# EAGLE design Adafruit GPS Logger Shield (EAGLE 6.3)
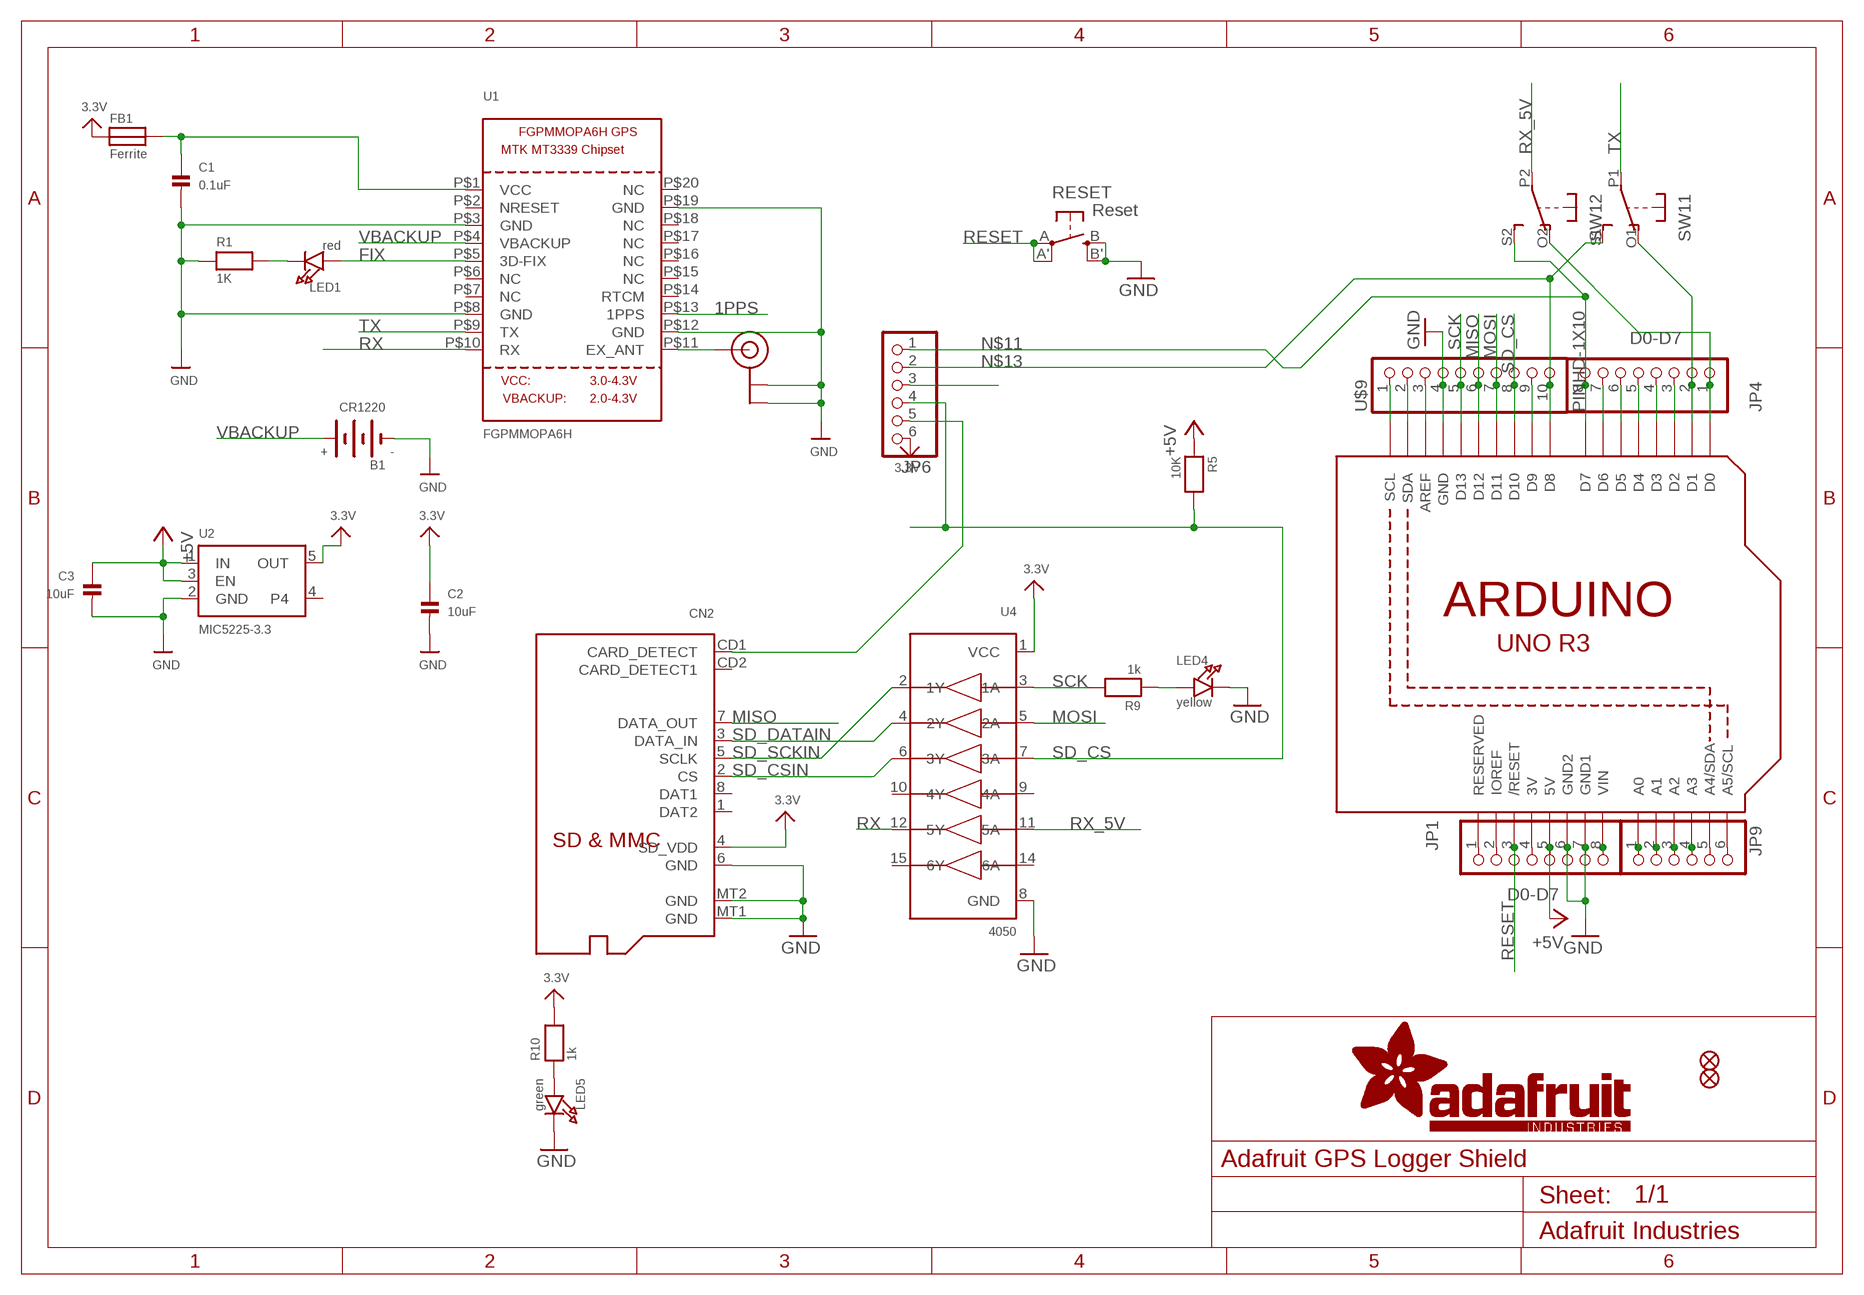
[diagram p0: schematic, sheet 1]

## Parts
B1  CR1220  BATTERYCR1220_SMT  [CR1220]
C1  0.1uF  CAP_CERAMIC0805  [0805@1]
C2  10uF  CAP_CERAMIC0805  [0805@1]
C3  10uF  CAP_CERAMIC0805  [0805@1]
CN2  MICROSD  [MICROSD]
FB1  Ferrite  FERRITE0805  [0805@1]
FID1  FIDUCIAL""  [FIDUCIAL_1MM]
FID2  FIDUCIAL""  [FIDUCIAL_1MM]
JP1  D0-D7  PINHD-1X8BIG  [1X08-BIG]
JP4  D0-D7  PINHD-1X8BIG  [1X08-BIG]
JP6  PINHD-1X6B  [1X06-BIG]
JP9  PINHD-1X6B  [1X06-BIG]
LED1  red  LED0805  [CHIPLED_0805]
LED4  yellow  LED0805  [CHIPLED_0805]
LED5  green  LED0805  [CHIPLED_0805]
R1  1K  RESISTOR0805  [0805]
R5  10K  RESISTOR0805  [0805]
R9  1k  RESISTOR0805  [0805]
R10  1k  RESISTOR0805  [0805]
RESET  Reset  SPST_TACT-EVQQ2  [EVQ-Q2]
SW1  DPDT-EG1390  [EG1390]
U1  FGPMMOPA6H  GPS_FGPMMOPA6H  [FGPMMOPA6H]
U2  MIC5225-3.3  VREG_SOT23-5  [SOT23-5]
U3  ARDUINOR3-DIMENSION  [ARDUINOR3]
U4  4050  74HC4050D  [SOIC16]
U$9  PINHD-1X10  [1X10-BIG]
U$20  U.FL  [U.FL]

## Nets
1PPS: JP6.3 U1.P$13(1PPS)
3.3V: C2.1 CN2.4(SD_VDD) FB1.1 JP6.6 R10.2 U2.5(OUT) U4.1(VCC)
+5V: C3.1 JP1.5 R5.1 U2.1(IN) U2.3(EN) U3.5V
FIX: LED1.A U1.P$5(3D-FIX)
GND: B1.- C1.2 C2.2 C3.2 CN2.6(GND) CN2.MT1(GND) CN2.MT2(GND) JP1.6 JP1.7 LED4.C LED5.C R1.1 RESET.B'(S1) RESET.B(S) U1.P$3(GND) U1.P$8(GND) U1.P$12(GND) U1.P$19(GND) U2.2(GND) U3.GND U3.GND1 U3.GND2 U4.8(GND) U$9.4 U$20.P$1(GND) U$20.P$2(GND)
MISO: CN2.7(DATA_OUT) U3.D12 U$9.6
MOSI: U3.D11 U4.5(2A) U$9.7
N$1: C1.1 FB1.2 U1.P$1(VCC)
N$2: LED1.C R1.2
N$3: JP1.1 U3.RESERVED
N$4: U1.P$11(EX_ANT) U$20.P$3(SIGNAL)
N$5: JP1.2 U3.IOREF
N$6: JP1.4 U3.3V
N$7: U3.SCL U$9.1
N$8: LED4.A R9.1
N$9: JP9.6 U3.A5(A5/SCL)
N$10: JP9.5 U3.A4(A4/SDA)
N$11: JP4.8 JP6.1 SW1.S2(2:S) U3.D7
N$12: U3.SDA U$9.2
N$13: JP6.2 SW1.S1(1:S) U3.D8 U$9.10
N$14: JP4.2 SW1.O1(1:O) U3.D1
N$15: JP1.8 U3.VIN
N$89: JP4.3 U3.D2
N$90: JP4.4 U3.D3
N$98: JP4.5 U3.D4
N$99: JP4.6 U3.D5
N$100: JP4.7 U3.D6
N$108: U3.AREF U$9.3
N$110: U3.D9 U$9.9
N$150: LED5.A R10.1
N$154: JP9.1 U3.A0
N$164: JP9.2 U3.A1
N$181: JP9.3 U3.A2
N$182: JP9.4 U3.A3
N$201: JP4.1 SW1.O2(2:O) U3.D0
RESET: JP1.3 RESET.A'(P1) RESET.A(P) U3.RESET(/RESET)
RX: U1.P$10(RX) U4.12(5Y)
RX_5V: SW1.P2(2:P) U4.11(5A)
SCK: R9.2 U3.D13 U4.3(1A) U$9.5
SD_CD: CN2.CD1(CARD_DETECT) JP6.5
SD_CS: JP6.4 R5.2 U3.D10 U4.7(3A) U$9.8
SD_CSIN: CN2.2(CS) U4.6(3Y)
SD_DATAIN: CN2.3(DATA_IN) U4.4(2Y)
SD_SCKIN: CN2.5(SCLK) U4.2(1Y)
TX: SW1.P1(1:P) U1.P$9(TX)
VBACKUP: B1.+$1(+) U1.P$4(VBACKUP)
Unconnected: CN2.1(DAT2) CN2.8(DAT1) CN2.CD2(CARD_DETECT1) U1.P$2(NRESET) U1.P$6(NC) U1.P$7(NC) U1.P$14(RTCM) U1.P$15(NC) U1.P$16(NC) U1.P$17(NC) U1.P$18(NC) U1.P$20(NC) U2.4 U4.9(4A) U4.10(4Y) U4.14(6A) U4.15(6Y)

## Library data of the parts
B1 = microbuilder:BATTERY
C1-C3 = microbuilder:CAP_CERAMIC: Ceramic Capacitors 0402 - 0402 Surface Mount Capacitors 16pF 50V 5% [Digikey: 445-4899-2-ND] 18pF 50V 5% [Digikey: 490-1281-2-ND] 22pF 50V 5% [Digikey: 490-1283-2-ND] 68pF 50V 5% [Digikey: 490-1289-2-ND] 0.1uF 10V 10% [Digikey: 490-1318-2-ND] 1.0uF 6.3V 10% [Digikey: 490-1320-2-ND] 0603 - 0603 Surface Mount Capacitors 16 pF 50V 5% [Digikey: 445-5051-2-ND] 22 pF 50V [Digikey: PCC220ACVTR-ND] 33 pF 50V 5% [Digikey: 490-1415-1-ND] 56pF 50V 5% [Digikey: 490-1421-1-ND] 220pF 50V 5% [Digikey: 445-1285-1-ND] 680 pF 50V 2200 pF 50V 5% C0G [Digikey: 445-1297-1-ND] 5600 pF 100V 5% X7R [Digikey: 478-3711-1-ND] 0.1 µF 25V 10% [Digikey: PCC2277TR-ND] 0.22 µF 16V 10% X7R [Digikey: 445-1318-1-ND] 1.0 µF 25V 10% [Digikey: 445-5146-2-ND] 0603 - RF Specific 3pF 250V +/-0.1pF RF [Digikey: 712-1347-1-ND] 18 pF 250V 5% [Digikey: 478-3505-1-ND or 712-1322-1-ND] 56 pF 250V 5% C0G RF [Digikey: 490-4867-1-ND] 68 pF 250V RF [Digikey: 490-4868-1-ND] 0805 - 0805 Surface Mount Capacitors 220 pF 250V 2% RF Ceramic Capacitor [Digikey: 712-1398-1-ND] 1000 pF 50V 2% NP0 Ceramic Capacitor [Digikey: 478-3760-1-ND] 0.1 µF 25V 10% Ceramic Capacitor [Digikey: PCC1828TR-ND] 1.0 µF 16V 10% Ceramic Capacitor[Digikey: 490-1691-2-ND] 10.0 µF 10V 10% Ceramic Capacitor[Digikey: 709-1228-1-ND] 10.0 uF 16V 10% Ceramic Capacitor [Digikey: 478-5165-2-ND] 47 uF 6.3V 20% Ceramic Capacitor [Digikey: 587-1779-1-ND or 399-5506-1-ND] 1206 - 1206 Surface Mount Capacitors 47uF 10V 20% Ceramic Capacitor [Digikey: 490-5528-1-ND or 399-5508-1-ND or 445-6010-1-ND] 100uF 6.3V -20%, +80% Y5V Ceramic Capacitor (Digikey: 490-4512-1-ND, Mouser: 81-GRM31CF50J107ZE1L)
CN2 = microbuilder:MICROSD: MicroSD/Transflash Card Holder with SPI pinout 3M: 2908-05WB-MG 4UConnector: 19656 Footprint courtesy: Adafruit Industries
FB1 = microbuilder:FERRITE: Ferrite Bead 0603 MMZ1608B121C - 120 Ohm, 600mA Ferrite Chip - Digikey: 445-2164-1-ND BK1608HW121-T - 120 Ohm, 600mA Ferrite Chip - Digikey: 587-1876-2-ND
FID1 FID2 = microbuilder:FIDUCIAL: Fiducial Alignment Points Various fiducial points for machine vision alignment.
JP1 JP4 = adafruit:PINHD-1X8: PIN HEADER
JP6 JP9 = adafruit:PINHD-1X6: PIN HEADER
LED1 LED4 LED5 = microbuilder:LED: LED 0603 - 0603 Surface Mount Package 2mA: Green LED - Low Power (3.9mcd, 2ma, 1.7Vf) - Digikey: 475-2709-2-ND Orange LED - Low Power (9.8mcd, 2ma, 1.8Vf) - Digikey: 475-1194-2-ND Red LED - Low Power (5mcd, 2ma, 1.8Vf) - Digikey: 475-1195-2-ND Yellow LED - Low Power (7mcd, 2ma, 1.8Vf) - Digikey: 475-1196-2-ND 5mA: Blue LED - Low Power (17mcd, 5ma, 2.9Vf) - Digikey: LNJ937W8CRACT-ND 0805 - 0805 Surface Mount Package 2mA: Red LED (8.8mcd, 2mA, 1.8Vf, Clear) - Low Power [Digikey: 475-2510-1-ND] Green LED (5mcd, 2mA, 1.8Vf, Clear) - Low Power [Digikey: 475-2730-1-ND] Yellow LED (11.3mcd, 2mA, 1.8Vf, Clear) - Low Power [Digikey: 475-2555-1-ND] 20mA: Red LED (104mcd, 20mA, Diffused) - LS R976 [Digikey: 475-1278-6-ND] Red LED (12mcd, 20mA, 2.0Vf, Clear) - APT2012EC [Digikey: 754-1128-1-ND] Green LED (15mcd, 20mA, 2.2Vf, Clear) - APT2012GC [Digikey: 754-1131-1-ND] Orange LED (160mcd, 20mA, 2.1Vf, Clear) - APT2012SECK [Digikey: 754-1130-1-ND] 1206 - 1206 Surface Mount Package Green LED (26mcd, 20mA, Diffused) - LG N971 [Digikey: 475-1407-6-ND] Red LED (15mcd, 20mA, Diffused) - LH N974 [Digikey: 475-1416-6-ND]
R1 R5 R9 R10 = microbuilder:RESISTOR: Resistors 0402 - 0402 Surface Mount Package 22 Ohm 1% 1/16W [Digikey: 311-22.0LRTR-ND] 33 Ohm 5% 1/16W 1.0K 5% 1/16W 1.5K 5% 1/16W 2.0K 1% 1/16W 10.0K 1% 1/16W [Digikey: 311-10.0KLRTR-ND] 10.0K 5% 1/16W [Digikey: RMCF0402JT10K0TR-ND] 12.1K 1% 1/16W [Digikey: 311-22.0LRTR-ND] 100.0K 5% 1/16W 0603 - 0603 Surface Mount Package 0 Ohm 1/10 Watt 1% Resistor 15 Ohm 1/10 Watt 1% Resistor 33 Ohm 1/10 Watt 1% Resistor 49.9 Ohm 1/10 Watt 1% Resistor 100 Ohm 1/10 Watt 1% Resistor 150 Ohm 1/10 Watt 1% Resistor 240 Ohm 1/10 Watt 1% Resistor 390 Ohm 1/10 Watt 1% Resistor 560 Ohm 1/10 Watt 1% Resistor 680 Ohm 1/10 Watt 1% Resistor 750 Ohm 1/10 Watt 1% Resistor 1.0K Ohm 1/10 Watt 1% Resistor 1.5K Ohm 1/10 Watt 1% Resistor 2.0K Ohm 1/10 Watt 1% Resistor 2.2K Ohm 1/10 Watt 1% Resistor 3.3K Ohm 1/10 Watt 1% Resistor 4.7K Ohm 1/10 Watt 1% Resistor 10.0K Ohm 1/10 Watt 1% Resistor 12.0K Ohm 1/10 Watt 1% Resistor 12.1K Ohm 1/10 Watt 1% Resistor 20.0K Ohm 1/10 Watt 1% Resistor 33.0K Ohm 1/10 Watt 1% Resistor 100.0K Ohm 1/10 Watt 1% Resistor 0805 - 0805 Surface Mount Package 0 Ohm 1/8 Watt 1% Resistor 33 Ohm 1/8 Watt 1% Resistor 100 Ohm 1/8 Watt 1% Resistor 150 Ohm 1/8 Watt 1% Resistor 200 Ohm 1/8 Watt 1% Resistor 240 Ohm 1/8 Watt 1% Resistor 330 Ohm 1/8 Watt 1% Resistor 390 Ohm 1/8 Watt 1% Resistor 470 Ohm 1/8 Watt 1% Resistor 1.0K Ohm 1/8 Watt 1% Resistor 1.5K Ohm 1/8 Watt 1% Resistor 2.0K Ohm 1/8 Watt 1% Resistor 4.7K Ohm 1/8 Watt 1% Resistor 5.1K Ohm 1/8 Watt 1% Resistor 5.6K Ohm 1/8 Watt 1% Resistor 10.0K Ohm 1/8 Watt 1% Resistor 22.0K Ohm 1/8 Watt 1% Resistor 33.0K Ohm 1/8 Watt 1% Resistor 100K Ohm 1/8 Watt 1% Resistor 1206 - 1206 Surface Mount Package 2012 - 2010 Surface Mount Package 0.11 Ohm 1/2 Watt 1% Resistor - Digikey: RHM.11UCT-ND
RESET = adafruit:SPST_TACT: SMT 6mm switch, EVQQ2 series http://www.ladyada.net/library/eagle
SW1 = adafruit:DPDT
U1 = microbuilder:GPS_FGPMMOPA6H: GPS Module - MTK MT3339 Chipset, -165dBm sensitivity, 22 channels, 10Hz, auto-select external antenna options
U2 = microbuilder:VREG_SOT23-5: SOT23-5 Fixed Voltage Regulators To better organise some of the SOT23-5 fixed voltage regulators in this library, this new part was created. Part Current Out V Out V In V Dropout Digikey Part No. ADP121 150mA 3.3V 3.4-5.5V 0.09V @ 150mA ADP121-AUJZ33R7CT-ND ADP121 150mA 3.0V 3.1-5.5V 0.09V @ 150mA ADP121-AUJZ30R7CT-ND ADP122 300mA 3.3V 3.4-5.5V 0.085V @ 300mA ADP122AUJZ-3.3-R7CT-ND ADP1712 300mA 3.3V 3.5-5.5V 0.17V @ 300mA ADP1712AUJZ-3.3-R7TR-ND AP7311 (Low Cost) 150mA 3.3V 3.5-6V 0.15V @ 150mA AP7311-33WG-7DICT-ND LD39015M18R 150mA 1.8V 1.9V-5.5V 0.08V @ 100mA 497-6977-1-ND MCP1824T-3302E/OT 300mA 3.3V 3.5V-6V 0.2V @ 300mA MCP1824T-3302E/OTCT-ND MIC5205-2.5YM5 TR 150mA 2.5V 2.7-16V 0.165V @ 150mA 576-1257-2-ND MIC5205-3.0YM5 TR 150mA 3.0V 3.2V-16V 0.165V @ 150mA 576-1258-2-ND MIC5205-3.3YM5 TR 150mA 3.3V 3.5V-16V 0.165V @ 150mA 576-1259-2-ND TPS780330220 150mA 3.3V+2.2V 3.6-5.5V 250mV Max 296-23332-1-ND TDA3663/N1,135 100mA 3.3V 3.5-45V 0.18V @ 50mA 568-5343-1-ND
U3 = adafruit:ARDUINOR3: This is a new object for the new Arduino R3 - with extra pins that you may want to use (such as IOref, and duplicated A4/A5
U4 = microbuilder:74HC4050D: 6-channel level shifter 74HC4050D - 2V-6V Supply Digikey: 74HC4050D,653-ND Mouser: 771-74HC4050D-T
U$9 = adafruit:PINHD-1X10: Pin header 1x10 0.1" spacing With round pins
U$20 = microbuilder:U.FL: U.FL Antenna Connector

## Board
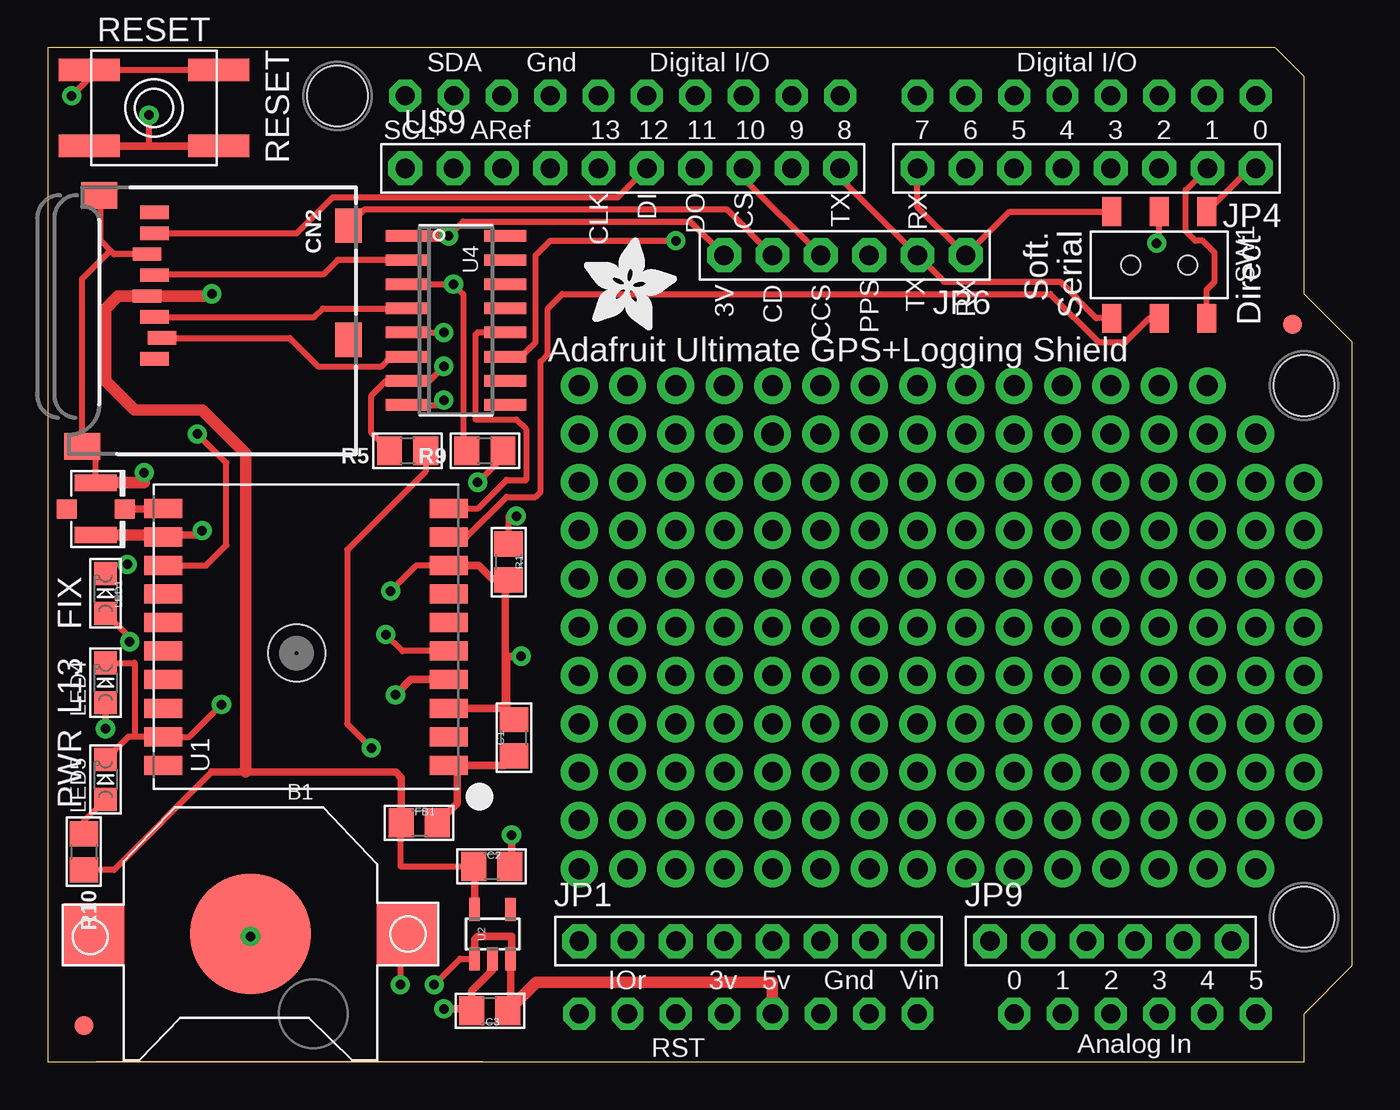
[diagram p1: board, top side]
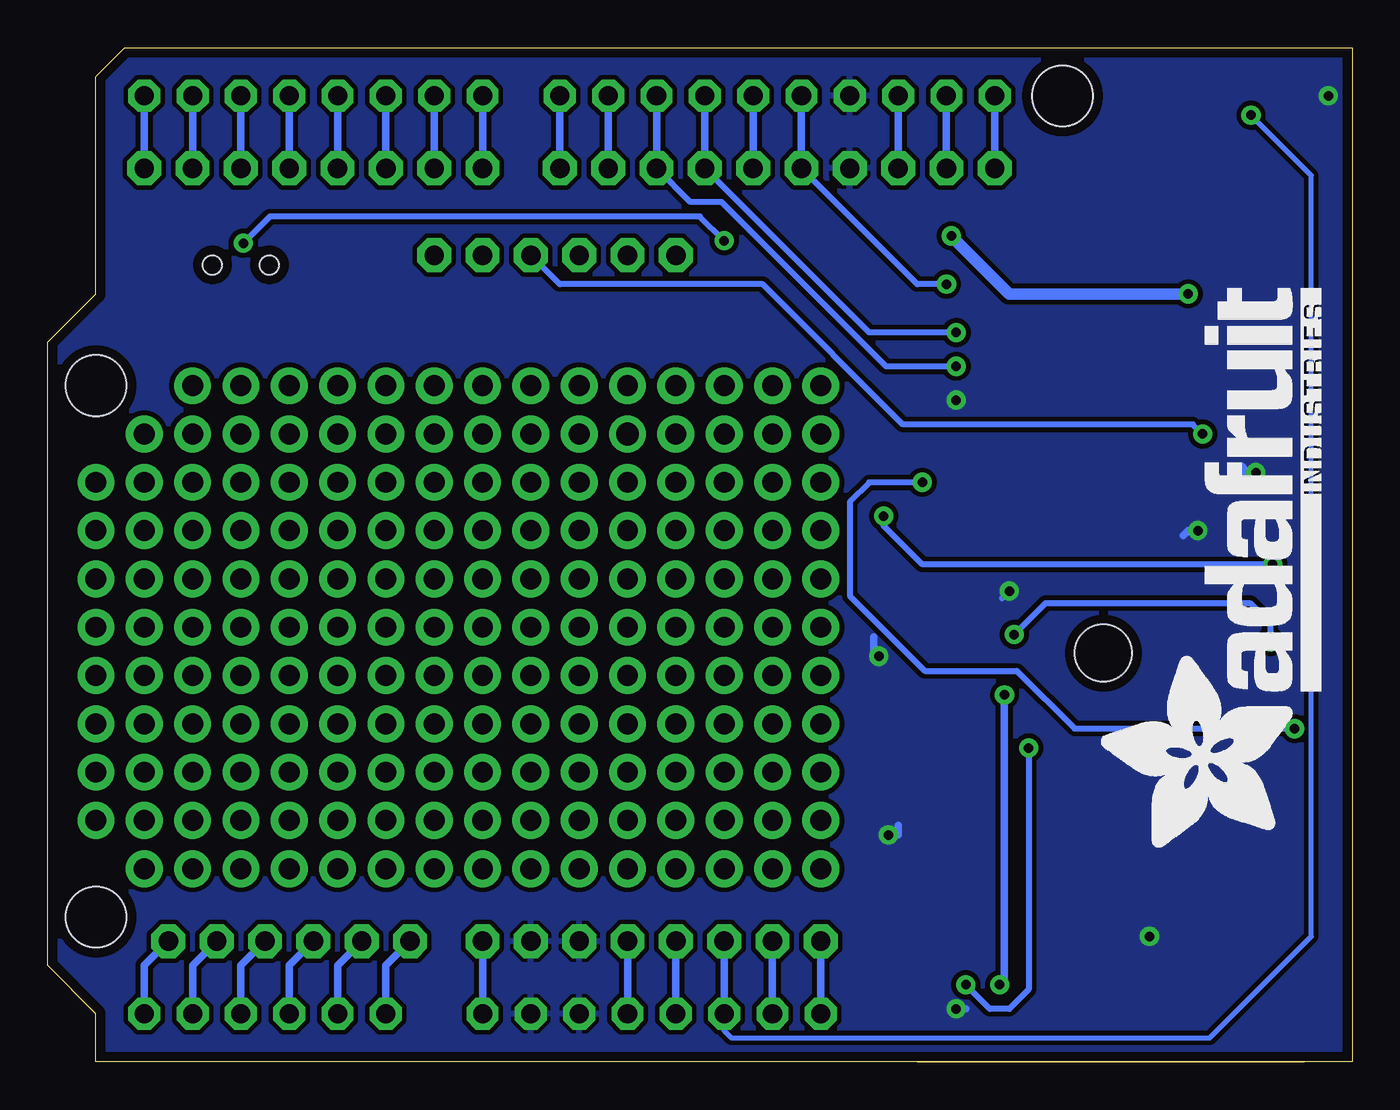
[diagram p2: board, bottom side, seen from below]

Size 68.58 x 53.34 mm. Coordinates in mm from the lower left corner, seen from the top.
Outline: 22.86,0 2.54,0
Copper layers (1*16): Top 0.035mm / dielectric 1.5mm / Bottom 0.035mm
Design rules "default": minimum track width 8mil, minimum drill 0.4mm, track to track 10mil, track to pad 10mil, pad to pad 10mil, via to via 10mil, smd to smd 8mil, copper to edge 20mil, drill to drill 8mil, minimum pad ring 8mil, minimum via ring 10mil, stop-mask expansion 3mil, vias tented up to drill 20mil, thermal gap 8mil
Holes 3.2 mm at 15.24,50.8 66.04,35.56 66.04,7.62

### Footprints (pad centres in the part's own frame; a part is rotated, then mirrored left to right if it is on the bottom)
CR1220 = smd 3.2 x 3.2: +$1 -8.225,0; +$2 8.225,0 | smd 6.35 x 6.35: - 0,0
0805@1 = smd 1.3 x 1.5: 1 -0.95,0; 2 0.95,0
MICROSD = smd 0.7 x 1.5: 1 9,-10.64; 2 7.9,-10.24; 3 6.8,-10.64; 4 5.7,-11.04; 5 4.6,-10.64; 6 3.5,-11.04; 7 2.4,-10.64; 8 1.3,-10.64 | smd 1.8 x 1.4: CD1 2,-0.44; CD2 8,-0.44 | smd 1.4 x 1.9: MT1 0.4,-13.54; MT2 13.6,-14.44
FIDUCIAL_1MM = smd 1 x 1: 1 0,0
1X08-BIG = drill 1.016 pad 1.778 octagon: 1 -8.89,0; 2 -6.35,0; 3 -3.81,0; 4 -1.27,0; 5 1.27,0; 6 3.81,0; 7 6.35,0; 8 8.89,0
1X06-BIG = drill 1.016 pad 1.778 octagon: 1 -6.35,0; 2 -3.81,0; 3 -1.27,0; 4 1.27,0; 5 3.81,0; 6 6.35,0
CHIPLED_0805 = smd 1.2 x 1.2: A 0,-1.05; C 0,1.05
0805 = smd 1.3 x 1.5: 1 -0.95,0; 2 0.95,0
EVQ-Q2 = smd 3.2 x 1.2: A -3.4,-2; A' 3.4,-2; B -3.4,2; B' 3.4,2
EG1390 = smd 1 x 1.5: O1 -2.5,2.8; O2 -2.5,-2.8; P1 0,2.8; P2 0,-2.8; S1 2.5,2.8; S2 2.5,-2.8 | hole 1: 1.5,0; -1.5,0
FGPMMOPA6H = smd 2 x 1: P$1 -7.5,6.75; P$2 -7.5,5.25; P$3 -7.5,3.75; P$4 -7.5,2.25; P$5 -7.5,0.75; P$6 -7.5,-0.75; P$7 -7.5,-2.25; P$8 -7.5,-3.75; P$9 -7.5,-5.25; P$10 -7.5,-6.75; P$11 7.5,-6.75; P$12 7.5,-5.25; P$13 7.5,-3.75; P$14 7.5,-2.25; P$15 7.5,-0.75; P$16 7.5,0.75; P$17 7.5,2.25; P$18 7.5,3.75; P$19 7.5,5.25; P$20 7.5,6.75 | hole 3: 0.5,0.85
SOT23-5 = smd 0.55 x 1.2: 1 -0.95,-1.3; 2 0,-1.3; 3 0.95,-1.3; 4 0.95,1.3; 5 -0.95,1.3
ARDUINOR3 = drill 1 pad 1.676 octagon: 3V 35.56,2.54; 5V 38.1,2.54; A0 50.8,2.54; A1 53.34,2.54; A2 55.88,2.54; A3 58.42,2.54; A4 60.96,2.54; A5 63.5,2.54; AREF 23.876,50.8; D0 63.5,50.8; D1 60.96,50.8; D2 58.42,50.8; D3 55.88,50.8; D4 53.34,50.8; D5 50.8,50.8; D6 48.26,50.8; D7 45.72,50.8; D8 41.656,50.8; D9 39.116,50.8; D10 36.576,50.8; D11 34.036,50.8; D12 31.496,50.8; D13 28.956,50.8; GND 26.416,50.8; GND1 43.18,2.54; GND2 40.64,2.54; IOREF 30.48,2.54; RESERVED 27.94,2.54; RESET 33.02,2.54; SCL 18.796,50.8; SDA 21.336,50.8; VIN 45.72,2.54
SOIC16 = smd 0.6 x 2.2: 1 -4.445,-2.6; 2 -3.175,-2.6; 3 -1.905,-2.6; 4 -0.635,-2.6; 5 0.635,-2.6; 6 1.905,-2.6; 7 3.175,-2.6; 8 4.445,-2.6; 9 4.445,2.6; 10 3.175,2.6; 11 1.905,2.6; 12 0.635,2.6; 13 -0.635,2.6; 14 -1.905,2.6; 15 -3.175,2.6; 16 -4.445,2.6
1X10-BIG = drill 1.016 pad 1.778 octagon: 1 -11.43,0; 2 -8.89,0; 3 -6.35,0; 4 -3.81,0; 5 -1.27,0; 6 1.27,0; 7 3.81,0; 8 6.35,0; 9 8.89,0; 10 11.43,0
U.FL = smd 2.2 x 0.85: P$1 0,1.375; P$2 0,-1.375 | smd 1.05 x 1: P$3 1.525,0; P$4 -1.525,0

### Placement (x,y rotation side)
B1  10.67,6.73 180 top
C1  24.51,17.04 90 top
C2  23.34,10.29 0 top
C3  23.24,2.69 180 top
CN2  16.26,45.97 270 top
FB1  19.53,12.57 0 top
FID1  1.91,1.91 0 top
FID2  65.43,38.78 0 top
JP1  36.83,6.35 0 top
JP4  54.61,46.99 180 top
JP6  41.91,42.42 180 top
JP9  55.88,6.35 0 top
LED1  3.05,24.64 0 top
LED4  3.05,19.94 0 top
LED5  3.05,14.86 0 top
R1  24.23,26.29 90 top
R5  18.92,32.13 180 top
R9  22.99,32.13 180 top
R10  1.91,11.05 270 top
RESET  5.59,50.16 0 top
SW1  58.42,41.91 180 top
U1  13.59,22.35 180 top
U2  23.39,6.73 0 top
U3  0,0 0 top
U4  21.46,38.99 270 top
U$9  30.23,46.99 0 top
U$13  [ADAFRUIT_5MM]  28.19,38.48 0 top
U$15  [ADAFRUIT_TEXT_30MM]  1.65,11.05 90 bottom
U$20  2.54,29.08 0 top

### Tracks (layer width: path | path; a pad name or v marks a point on that pad's centre or on a via)
1PPS  (via drill 0.5)
  Top 0.305: U1.P$13 8.32,26.1 9.4,27.18 9.4,31.5 v7.87,33.02
  Bottom 0.305: v7.87,33.02 8.38,33.53 23.62,33.53 30.99,40.89 41.66,40.89 JP6.3
3.3V  (via drill 0.5)
  Top 0.305: 8.64,15.24 3.5,10.1 R10.2 | 18.54,12.53 18.54,10.29 C2.1 | v21.08,43.43 21.84,44.2 33.78,44.2 JP6.6
  Top 0.406: C2.1 22.44,10.24 U2.5 | 18.54,12.53 FB1.1 18.58,14.94 18.29,15.24 10.41,15.24 8.64,15.24
  Top 0.61: 10.41,15.24 10.41,32 8.13,34.29 4.57,34.29 3.05,35.81 3.05,39.62 3.7,40.27 CN2.4 8.52,40.27 v8.64,40.39 | U4.1 v21.08,43.43
  Bottom 0.61: v21.08,43.43 18.03,40.39 v8.64,40.39
+5V  (via drill 0.5)
  Top 0.305: R5.1 19.87,31.05 15.75,26.92 15.75,17.78 v17.02,16.51 | v20.32,4.06 21.69,5.43 U2.1
  Top 0.406: U2.1 22.44,6.44 22.61,6.6 24.38,6.6 24.38,5.47 U2.3 24.34,2.84 C3.1
  Top 0.61: C3.1 25.69,4.19 38.1,4.19 U3.5V
  Bottom 0.305: v17.02,16.51 17.02,3.81 18.03,2.79 19.05,2.79 v20.32,4.06
  Bottom 0.406: U3.5V JP1.5
FIX  (via drill 0.5)
  Top 0.305: LED1.A 4.32,22.32 v4.32,22.1 | U1.P$5 18.66,21.6 v17.78,22.48
  Bottom 0.305: v17.78,22.48 16.13,24.13 5.38,24.13 4.32,23.07 v4.32,22.1
GND  (via drill 0.5)
  Top 0.305: RESET.B' RESET.B 2.19,51.72 v1.27,50.8 | CN2.6 3.5,42.47 3.3,42.67 | 3.3,42.67 2.79,43.18 2.79,45.5 CN2.MT1 | 3.3,42.67 1.82,41.19 CN2.MT2 2.54,31.65 U$20.P$1 | 4.57,17.1 U1.P$19 7.45,17.1 v9.14,18.8 | 4.57,17.1 4.24,17.1 LED5.C | U4.8 20.57,34.54 v20.83,34.8 | LED4.C 4.57,20.99 4.57,17.1 | U1.P$8 19.37,26.1 v18.03,24.77
  Top 0.406: U1.P$3 23.9,18.6 24.05,18.46 | 24.05,18.46 C1.2 24.13,17.99 24.13,21.34 v24.89,21.34 | U1.P$8 22.67,26.1 23.37,25.4 24.11,25.4 | 24.05,18.46 24.05,25.34 24.11,25.4 | U2.2 23.37,5.41 23.37,4.83 22.29,3.75 C3.2 22.19,2.79 v20.83,2.79 | C2.2 24.38,10.29 v24.38,11.94 | U$20.P$2 7.9,27.71 v8.13,27.94 | B1.- v10.67,6.6 | R1.1 24.17,25.4 24.11,25.4
  Top 0.61: U$20.P$2 5.98,27.71 U1.P$12 | U$20.P$1 5.08,30.46 v5.08,30.99
  Bottom 0.305: v1.27,50.8 1.27,50.55 | v20.83,34.8 21.08,34.54 | v18.03,24.77 18.41,24.38
  Bottom 0.406: v20.83,2.79 20.32,2.79 | v24.89,21.34 25.15,21.34 25.15,22.35 | v24.38,11.94 23.88,11.94 23.88,12.45 | v8.13,27.94 8.64,27.94 8.89,27.69
  Bottom 0.61: v5.08,30.99 5.84,30.99 5.84,31.24
  pour Bottom: 0,0 66.04,0 66.04,2.54 68.58,5.08 68.58,37.85 66.04,40.39 66.04,51.82 64.52,53.34 0,53.34
MISO
  Top 0.305: CN2.7 13.09,43.57 14.99,45.47 29.97,45.47 U$9.6
  Bottom 0.406: U3.D12 U$9.6
MOSI  (via drill 0.5)
  Top 0.305: U4.5 v20.83,38.35
  Bottom 0.305: v20.83,38.35 25.4,38.35 U$9.7
  Bottom 0.406: U3.D11 U$9.7
N$1
  Top 0.406: C1.1 24.02,15.6 U1.P$1 21.52,15.17 21.52,13.61 FB1.2
N$2  (via drill 0.5)
  Top 0.254: LED1.C 3.52,26.16 v4.19,26.16
  Top 0.305: R1.2 24.23,28.7 v24.64,28.7
  Bottom 0.305: v4.19,26.16 22.61,26.16 24.64,28.19 v24.64,28.7
N$3
  Bottom 0.406: U3.RESERVED JP1.1
N$4
  Top 0.406: U$20.P$3 6.07,29.08 U1.P$11
N$5
  Bottom 0.406: U3.IOREF JP1.2
N$6
  Bottom 0.406: JP1.4 U3.3V | U3.3V 35.56,2.29 35.81,2.03 35.81,2.29 U3.3V
N$7
  Bottom 0.406: U3.SCL U$9.1
N$8  (via drill 0.5)
  Top 0.305: v3.05,17.53 LED4.A | R9.1 23.94,31.81 v22.61,30.48
  Bottom 0.305: v22.61,30.48 25.4,30.48 26.42,29.46 26.42,24.51 22.48,20.57 17.65,20.57 14.61,17.53 v3.05,17.53
N$9
  Bottom 0.406: U3.A5 63.5,5.08 JP9.6
N$10
  Bottom 0.406: U3.A4 60.96,5.08 JP9.5
N$11
  Top 0.305: JP4.8 45.72,44.96 JP6.1 50.55,44.71 SW1.S2
  Bottom 0.406: U3.D7 JP4.8
N$12
  Bottom 0.406: U3.SDA U$9.2
N$13
  Top 0.305: SW1.S1 55.12,39.11 53.21,41.02 47.12,41.02 JP6.2 41.66,46.48 U$9.10
  Bottom 0.406: U3.D8 U$9.10
N$14
  Top 0.305: SW1.O1 60.92,40.6 61.34,41.02 61.34,42.55 60.71,43.18 60.33,43.18 59.82,43.69 59.82,45.85 JP4.2
  Bottom 0.406: JP4.2 U3.D1
N$15
  Bottom 0.406: U3.VIN JP1.8
N$17  (via drill 1.1 pad 1.93)
  other vias: 43.18,33.02
N$18  (via drill 1.1 pad 1.93)
  other vias: 40.64,33.02
N$19  (via drill 1.1 pad 1.93)
  other vias: 48.26,33.02
N$20  (via drill 1.1 pad 1.93)
  other vias: 35.56,33.02
N$21  (via drill 1.1 pad 1.93)
  other vias: 33.02,30.48
N$22  (via drill 1.1 pad 1.93)
  other vias: 33.02,27.94
N$23  (via drill 1.1 pad 1.93)
  other vias: 45.72,33.02
N$24  (via drill 1.1 pad 1.93)
  other vias: 50.8,30.48
N$25  (via drill 1.1 pad 1.93)
  other vias: 48.26,30.48
N$26  (via drill 1.1 pad 1.93)
  other vias: 45.72,30.48
N$27  (via drill 1.1 pad 1.93)
  other vias: 43.18,30.48
N$28  (via drill 1.1 pad 1.93)
  other vias: 40.64,30.48
N$29  (via drill 1.1 pad 1.93)
  other vias: 38.1,30.48
N$30  (via drill 1.1 pad 1.93)
  other vias: 35.56,30.48
N$31  (via drill 1.1 pad 1.93)
  other vias: 50.8,27.94
N$32  (via drill 1.1 pad 1.93)
  other vias: 38.1,27.94
N$33  (via drill 1.1 pad 1.93)
  other vias: 40.64,27.94
N$34  (via drill 1.1 pad 1.93)
  other vias: 43.18,27.94
N$35  (via drill 1.1 pad 1.93)
  other vias: 45.72,27.94
N$36  (via drill 1.1 pad 1.93)
  other vias: 48.26,27.94
N$37  (via drill 1.1 pad 1.93)
  other vias: 50.8,10.16
N$38  (via drill 1.1 pad 1.93)
  other vias: 50.8,25.4
N$39  (via drill 1.1 pad 1.93)
  other vias: 50.8,22.86
N$40  (via drill 1.1 pad 1.93)
  other vias: 50.8,20.32
N$41  (via drill 1.1 pad 1.93)
  other vias: 53.34,12.7
N$42  (via drill 1.1 pad 1.93)
  other vias: 35.56,25.4
N$43  (via drill 1.1 pad 1.93)
  other vias: 38.1,25.4
N$44  (via drill 1.1 pad 1.93)
  other vias: 40.64,25.4
N$45  (via drill 1.1 pad 1.93)
  other vias: 43.18,25.4
N$46  (via drill 1.1 pad 1.93)
  other vias: 45.72,25.4
N$47  (via drill 1.1 pad 1.93)
  other vias: 48.26,25.4
N$48  (via drill 1.1 pad 1.93)
  other vias: 53.34,25.4
N$49  (via drill 1.1 pad 1.93)
  other vias: 53.34,10.16
N$50  (via drill 1.1 pad 1.93)
  other vias: 53.34,20.32
N$51  (via drill 1.1 pad 1.93)
  other vias: 53.34,33.02
N$52  (via drill 1.1 pad 1.93)
  other vias: 53.34,27.94
N$53  (via drill 1.1 pad 1.93)
  other vias: 43.18,10.16
N$54  (via drill 1.1 pad 1.93)
  other vias: 33.02,12.7
N$55  (via drill 1.1 pad 1.93)
  other vias: 53.34,22.86
N$56  (via drill 1.1 pad 1.93)
  other vias: 48.26,22.86
N$57  (via drill 1.1 pad 1.93)
  other vias: 45.72,22.86
N$58  (via drill 1.1 pad 1.93)
  other vias: 43.18,22.86
N$59  (via drill 1.1 pad 1.93)
  other vias: 40.64,22.86
N$60  (via drill 1.1 pad 1.93)
  other vias: 38.1,22.86
N$61  (via drill 1.1 pad 1.93)
  other vias: 35.56,22.86
N$62  (via drill 1.1 pad 1.93)
  other vias: 33.02,25.4
N$63  (via drill 1.2 pad 1.93)
  other vias: 38.1,33.02
N$64  (via drill 1.1 pad 1.93)
  other vias: 50.8,15.24
N$65  (via drill 1.1 pad 1.93)
  other vias: 53.34,17.78
N$66  (via drill 1.1 pad 1.93)
  other vias: 35.56,20.32
N$67  (via drill 1.1 pad 1.93)
  other vias: 38.1,20.32
N$68  (via drill 1.1 pad 1.93)
  other vias: 40.64,20.32
N$69  (via drill 1.1 pad 1.93)
  other vias: 43.18,20.32
N$70  (via drill 1.1 pad 1.93)
  other vias: 45.72,20.32
N$71  (via drill 1.1 pad 1.93)
  other vias: 48.26,20.32
N$72  (via drill 1.1 pad 1.93)
  other vias: 58.42,33.02
N$73  (via drill 1.1 pad 1.93)
  other vias: 60.96,30.48
N$74  (via drill 1.1 pad 1.93)
  other vias: 50.8,33.02
N$75  (via drill 1.1 pad 1.93)
  other vias: 48.26,10.16
N$76  (via drill 1.1 pad 1.93)
  other vias: 45.72,10.16
N$77  (via drill 1.1 pad 1.93)
  other vias: 38.1,10.16
N$78  (via drill 1.1 pad 1.93)
  other vias: 35.56,17.78
N$79  (via drill 1.1 pad 1.93)
  other vias: 38.1,17.78
N$80  (via drill 1.1 pad 1.93)
  other vias: 40.64,17.78
N$81  (via drill 1.1 pad 1.93)
  other vias: 43.18,17.78
N$82  (via drill 1.1 pad 1.93)
  other vias: 45.72,17.78
N$83  (via drill 1.1 pad 1.93)
  other vias: 48.26,17.78
N$84  (via drill 1.1 pad 1.93)
  other vias: 50.8,17.78
N$85  (via drill 1.1 pad 1.93)
  other vias: 35.56,10.16
N$86  (via drill 1.1 pad 1.93)
  other vias: 40.64,10.16
N$87  (via drill 1.1 pad 1.93)
  other vias: 58.42,30.48
N$88  (via drill 1.1 pad 1.93)
  other vias: 55.88,27.94
N$89
  Bottom 0.406: JP4.3 U3.D2
N$90
  Bottom 0.406: U3.D3 JP4.4
N$91  (via drill 1.1 pad 1.93)
  other vias: 53.34,15.24
N$92  (via drill 1.1 pad 1.93)
  other vias: 48.26,15.24
N$93  (via drill 1.1 pad 1.93)
  other vias: 45.72,15.24
N$94  (via drill 1.1 pad 1.93)
  other vias: 43.18,15.24
N$95  (via drill 1.1 pad 1.93)
  other vias: 40.64,15.24
N$96  (via drill 1.1 pad 1.93)
  other vias: 38.1,15.24
N$97  (via drill 1.1 pad 1.93)
  other vias: 35.56,15.24
N$98
  Bottom 0.406: U3.D4 JP4.5
N$99
  Bottom 0.406: U3.D5 JP4.6
N$100
  Bottom 0.406: U3.D6 JP4.7
N$101  (via drill 1.1 pad 1.93)
  other vias: 58.42,27.94
N$102  (via drill 1.1 pad 1.93)
  other vias: 35.56,12.7
N$103  (via drill 1.1 pad 1.93)
  other vias: 38.1,12.7
N$104  (via drill 1.1 pad 1.93)
  other vias: 40.64,12.7
N$105  (via drill 1.1 pad 1.93)
  other vias: 43.18,12.7
N$106  (via drill 1.1 pad 1.93)
  other vias: 45.72,12.7
N$107  (via drill 1.1 pad 1.93)
  other vias: 48.26,12.7
N$108
  Bottom 0.406: U3.AREF U$9.3
N$109  (via drill 1.1 pad 1.93)
  other vias: 50.8,12.7
N$110
  Bottom 0.406: U3.D9 U$9.9
N$111  (via drill 1.1 pad 1.93)
  other vias: 55.88,25.4
N$112  (via drill 1.1 pad 1.93)
  other vias: 33.02,22.86
N$113  (via drill 1.1 pad 1.93)
  other vias: 33.02,20.32
N$114  (via drill 1.1 pad 1.93)
  other vias: 33.02,17.78
N$115  (via drill 1.1 pad 1.93)
  other vias: 33.02,15.24
N$116  (via drill 1.1 pad 1.93)
  other vias: 33.02,10.16
N$117  (via drill 1.1 pad 1.93)
  other vias: 53.34,30.48
N$118  (via drill 1.1 pad 1.93)
  other vias: 33.02,33.02
N$119  (via drill 1.1 pad 1.93)
  other vias: 30.48,30.48
N$120  (via drill 1.1 pad 1.93)
  other vias: 30.48,27.94
N$121  (via drill 1.1 pad 1.93)
  other vias: 30.48,25.4
N$122  (via drill 1.1 pad 1.93)
  other vias: 30.48,22.86
N$123  (via drill 1.1 pad 1.93)
  other vias: 30.48,20.32
N$124  (via drill 1.1 pad 1.93)
  other vias: 30.48,17.78
N$125  (via drill 1.1 pad 1.93)
  other vias: 30.48,15.24
N$126  (via drill 1.1 pad 1.93)
  other vias: 30.48,12.7
N$127  (via drill 1.1 pad 1.93)
  other vias: 30.48,10.16
N$128  (via drill 1.1 pad 1.93)
  other vias: 27.94,12.7
N$129  (via drill 1.1 pad 1.93)
  other vias: 27.94,15.24
N$130  (via drill 1.1 pad 1.93)
  other vias: 27.94,17.78
N$131  (via drill 1.1 pad 1.93)
  other vias: 27.94,20.32
N$132  (via drill 1.1 pad 1.93)
  other vias: 27.94,22.86
N$133  (via drill 1.1 pad 1.93)
  other vias: 58.42,25.4
N$134  (via drill 1.1 pad 1.93)
  other vias: 58.42,22.86
N$135  (via drill 1.1 pad 1.93)
  other vias: 55.88,22.86
N$136  (via drill 1.1 pad 1.93)
  other vias: 55.88,20.32
N$137  (via drill 1.1 pad 1.93)
  other vias: 58.42,20.32
N$138  (via drill 1.1 pad 1.93)
  other vias: 53.34,35.56
N$139  (via drill 1.1 pad 1.93)
  other vias: 50.8,35.56
N$140  (via drill 1.1 pad 1.93)
  other vias: 48.26,35.56
N$141  (via drill 1.1 pad 1.93)
  other vias: 45.72,35.56
N$142  (via drill 1.1 pad 1.93)
  other vias: 43.18,35.56
N$143  (via drill 1.1 pad 1.93)
  other vias: 40.64,35.56
N$144  (via drill 1.1 pad 1.93)
  other vias: 38.1,35.56
N$145  (via drill 1.1 pad 1.93)
  other vias: 35.56,35.56
N$146  (via drill 1.1 pad 1.93)
  other vias: 33.02,35.56
N$147  (via drill 1.1 pad 1.93)
  other vias: 30.48,35.56
N$148  (via drill 1.1 pad 1.93)
  other vias: 27.94,25.4
N$149  (via drill 1.1 pad 1.93)
  other vias: 55.88,17.78
N$150
  Top 0.305: LED5.A 1.91,12.67 R10.1
N$151  (via drill 1.1 pad 1.93)
  other vias: 27.94,35.56
N$152  (via drill 1.1 pad 1.93)
  other vias: 27.94,33.02
N$153  (via drill 1.1 pad 1.93)
  other vias: 27.94,30.48
N$154
  Bottom 0.406: U3.A0 50.8,5.08 JP9.1
N$155  (via drill 1.1 pad 1.93)
  other vias: 27.94,27.94
N$156  (via drill 1.1 pad 1.93)
  other vias: 35.56,27.94
N$157  (via drill 1.1 pad 1.93)
  other vias: 27.94,10.16
N$158  (via drill 1.1 pad 1.93)
  other vias: 58.42,17.78
N$159  (via drill 1.1 pad 1.93)
  other vias: 30.48,33.02
N$160  (via drill 1.1 pad 1.93)
  other vias: 60.96,17.78
N$161  (via drill 1.1 pad 1.93)
  other vias: 58.42,15.24
N$162  (via drill 1.1 pad 1.93)
  other vias: 55.88,15.24
N$163  (via drill 1.1 pad 1.93)
  other vias: 55.88,12.7
N$164
  Bottom 0.406: U3.A1 53.34,5.08 JP9.2
N$165  (via drill 1.1 pad 1.93)
  other vias: 58.42,12.7
N$166  (via drill 1.1 pad 1.93)
  other vias: 60.96,12.7
N$167  (via drill 1.1 pad 1.93)
  other vias: 63.5,12.7
N$168  (via drill 1.1 pad 1.93)
  other vias: 63.5,10.16
N$169  (via drill 1.1 pad 1.93)
  other vias: 60.96,10.16
N$170  (via drill 1.1 pad 1.93)
  other vias: 63.5,15.24
N$171  (via drill 1.1 pad 1.93)
  other vias: 60.96,15.24
N$172  (via drill 1.1 pad 1.93)
  other vias: 63.5,17.78
N$173  (via drill 1.1 pad 1.93)
  other vias: 55.88,33.02
N$174  (via drill 1.1 pad 1.93)
  other vias: 55.88,30.48
N$175  (via drill 1.1 pad 1.93)
  other vias: 60.96,27.94
N$176  (via drill 1.1 pad 1.93)
  other vias: 63.5,25.4
N$177  (via drill 1.1 pad 1.93)
  other vias: 60.96,25.4
N$178  (via drill 1.1 pad 1.93)
  other vias: 63.5,22.86
N$179  (via drill 1.1 pad 1.93)
  other vias: 60.96,22.86
N$180  (via drill 1.1 pad 1.93)
  other vias: 60.96,20.32
N$181
  Bottom 0.406: U3.A2 55.88,5.08 JP9.3
N$182
  Bottom 0.406: U3.A3 58.42,5.08 JP9.4
N$183  (via drill 1.1 pad 1.93)
  other vias: 63.5,20.32
N$184  (via drill 1.1 pad 1.93)
  other vias: 63.5,27.94
N$185  (via drill 1.1 pad 1.93)
  other vias: 63.5,33.02
N$186  (via drill 1.1 pad 1.93)
  other vias: 60.96,33.02
N$187  (via drill 1.1 pad 1.93)
  other vias: 58.42,10.16
N$188  (via drill 1.1 pad 1.93)
  other vias: 55.88,10.16
N$189  (via drill 1.1 pad 1.93)
  other vias: 63.5,30.48
N$190  (via drill 1.1 pad 1.93)
  other vias: 66.04,12.7
N$191  (via drill 1.1 pad 1.93)
  other vias: 60.96,35.56
N$192  (via drill 1.1 pad 1.93)
  other vias: 58.42,35.56
N$193  (via drill 1.1 pad 1.93)
  other vias: 55.88,35.56
N$194  (via drill 1.1 pad 1.93)
  other vias: 66.04,15.24
N$195  (via drill 1.1 pad 1.93)
  other vias: 66.04,17.78
N$196  (via drill 1.1 pad 1.93)
  other vias: 66.04,25.4
N$197  (via drill 1.1 pad 1.93)
  other vias: 66.04,22.86
N$198  (via drill 1.1 pad 1.93)
  other vias: 66.04,20.32
N$199  (via drill 1.1 pad 1.93)
  other vias: 66.04,27.94
N$200  (via drill 1.1 pad 1.93)
  other vias: 66.04,30.48
N$201
  Top 0.305: SW1.O2 63.2,46.99 JP4.1
  Bottom 0.406: U3.D0 JP4.1
RESET  (via drill 0.5)
  Top 0.305: 9.81,48.16 5.33,48.16 v5.33,49.78
  Top 0.406: RESET.A 5.33,48.16 RESET.A' | RESET.A' 9.81,48.16 9.91,48.26 9.08,48.26 RESET.A'
  Bottom 0.254: U3.RESET 33.02,1.65 32.64,1.27 7.49,1.27 2.16,6.6 2.16,46.61 v5.33,49.78
  Bottom 0.406: U3.RESET JP1.3
RX
  Top 0.305: U1.P$10 22.62,29.1 24.13,30.61 25.15,30.61 25.15,33.27 24.64,33.78 22.48,33.78 22.48,38.23 22.61,38.35 U4.12
RX_5V  (via drill 0.5)
  Top 0.305: U4.11 24.89,37.08 25.65,37.85 25.65,42.42 26.42,43.18 v33.02,43.18 | v58.29,43.05 58.42,43.18 SW1.P2
  Bottom 0.305: v33.02,43.18 34.29,44.45 56.9,44.45 v58.29,43.05
SCK  (via drill 0.5)
  Top 0.305: U4.3 v21.34,40.89 21.84,40.39 21.84,32.45 22.04,32.25 R9.2
  Bottom 0.305: v21.34,40.89 22.86,40.89 U$9.5
  Bottom 0.406: U3.D13 U$9.5
SD_CD
  Top 0.305: CN2.CD1 16.67,44.83 35.69,44.83 JP6.5
SD_CS  (via drill 0.5)
  Top 0.305: R5.2 17.02,33.09 17.02,35.05 17.78,35.81 U4.7 20.07,35.81 v20.83,36.58 | JP6.4 36.58,46.48 U$9.8
  Bottom 0.305: v20.83,36.58 24.51,36.58 33.15,45.21 34.8,45.21 U$9.8
  Bottom 0.406: U3.D10 U$9.8
SD_CSIN
  Top 0.305: CN2.2 12.73,38.07 14.22,36.58 17.53,36.58 18.03,37.08 U4.6
SD_DATAIN
  Top 0.305: CN2.3 14.03,39.17 14.48,39.62 U4.4
SD_SCKIN
  Top 0.305: U4.2 15.24,42.16 14.48,41.4 5.64,41.4 CN2.5
TX
  Top 0.305: U1.P$9 22.01,27.6 24.13,29.72 25.65,29.72 25.91,29.97 25.91,36.83 26.29,37.21 26.29,39.62 27.05,40.39 52.7,40.39 55.24,37.85 56.64,37.85 57.91,39.11 SW1.P1
VBACKUP  (via drill 0.5)
  Top 0.305: B1.+$1 18.54,6.38 v18.54,4.06
  Top 0.406: U1.P$4 19.09,20.1 v18.29,19.3
  Bottom 0.406: v18.29,19.3 18.29,4.32 v18.54,4.06

### Text on the board
tPlace: RESET | CLK | DI | DO | CS | TX | RX | 3V | CD | CCS | PPS | TX | RX | Soft. | Serial | Direct | Adafruit Ultimate GPS+Logging Shield | FIX | L13 | PWR